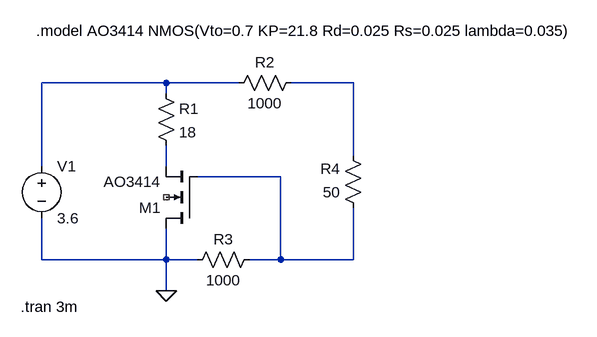
[diagram p0: schematic External Balancer Sim.asc]
External Balancer Sim.asc, the LTspice schematic file:
Version 4.1
SHEET 1 1688 680
WIRE 144 272 -48 272
WIRE 256 272 144 272
WIRE 432 272 336 272
WIRE 144 288 144 272
WIRE 432 384 432 272
WIRE -48 400 -48 272
WIRE 144 400 144 368
WIRE 320 416 192 416
WIRE -48 544 -48 480
WIRE 144 544 144 496
WIRE 144 544 -48 544
WIRE 192 544 144 544
WIRE 320 544 320 416
WIRE 320 544 272 544
WIRE 432 544 432 464
WIRE 432 544 320 544
WIRE 144 592 144 544
FLAG 144 592 0
SYMBOL voltage -48 384 R0
WINDOW 123 0 0 Left 0
WINDOW 39 0 0 Left 0
SYMATTR InstName V1
SYMATTR Value 3.6
SYMBOL nmos4 192 496 R180
SYMATTR InstName M1
SYMATTR Value AO3414
SYMBOL res 128 272 R0
SYMATTR InstName R1
SYMATTR Value 18
SYMBOL res 352 256 R90
WINDOW 0 0 56 VBottom 2
WINDOW 3 32 56 VTop 2
SYMATTR InstName R2
SYMATTR Value 1000
SYMBOL res 288 528 R90
WINDOW 0 0 56 VBottom 2
WINDOW 3 32 56 VTop 2
SYMATTR InstName R3
SYMATTR Value 1000
SYMBOL res 448 480 R180
WINDOW 0 36 76 Left 2
WINDOW 3 36 40 Left 2
SYMATTR InstName R4
SYMATTR Value 50
TEXT -56 192 Left 2 !.model AO3414 NMOS(Vto=0.7 KP=21.8 Rd=0.025 Rs=0.025 lambda=0.035)
TEXT -80 616 Left 2 !.tran 3m

The netlist it stands for:
* External Balancer Sim.asc
V1 N001 0 3.6
M1 0 N004 N003 NC_01 AO3414
R1 N001 N003 18
R2 N002 N001 1000
R3 N004 0 1000
R4 N004 N002 50
.model NMOS NMOS
.model PMOS PMOS
.lib standard.mos
.model AO3414 NMOS(Vto=0.7 KP=21.8 Rd=0.025 Rs=0.025 lambda=0.035)
.tran 3m
.backanno
.end